# Altium schematic sheet Sheet1.SchDoc
size A2
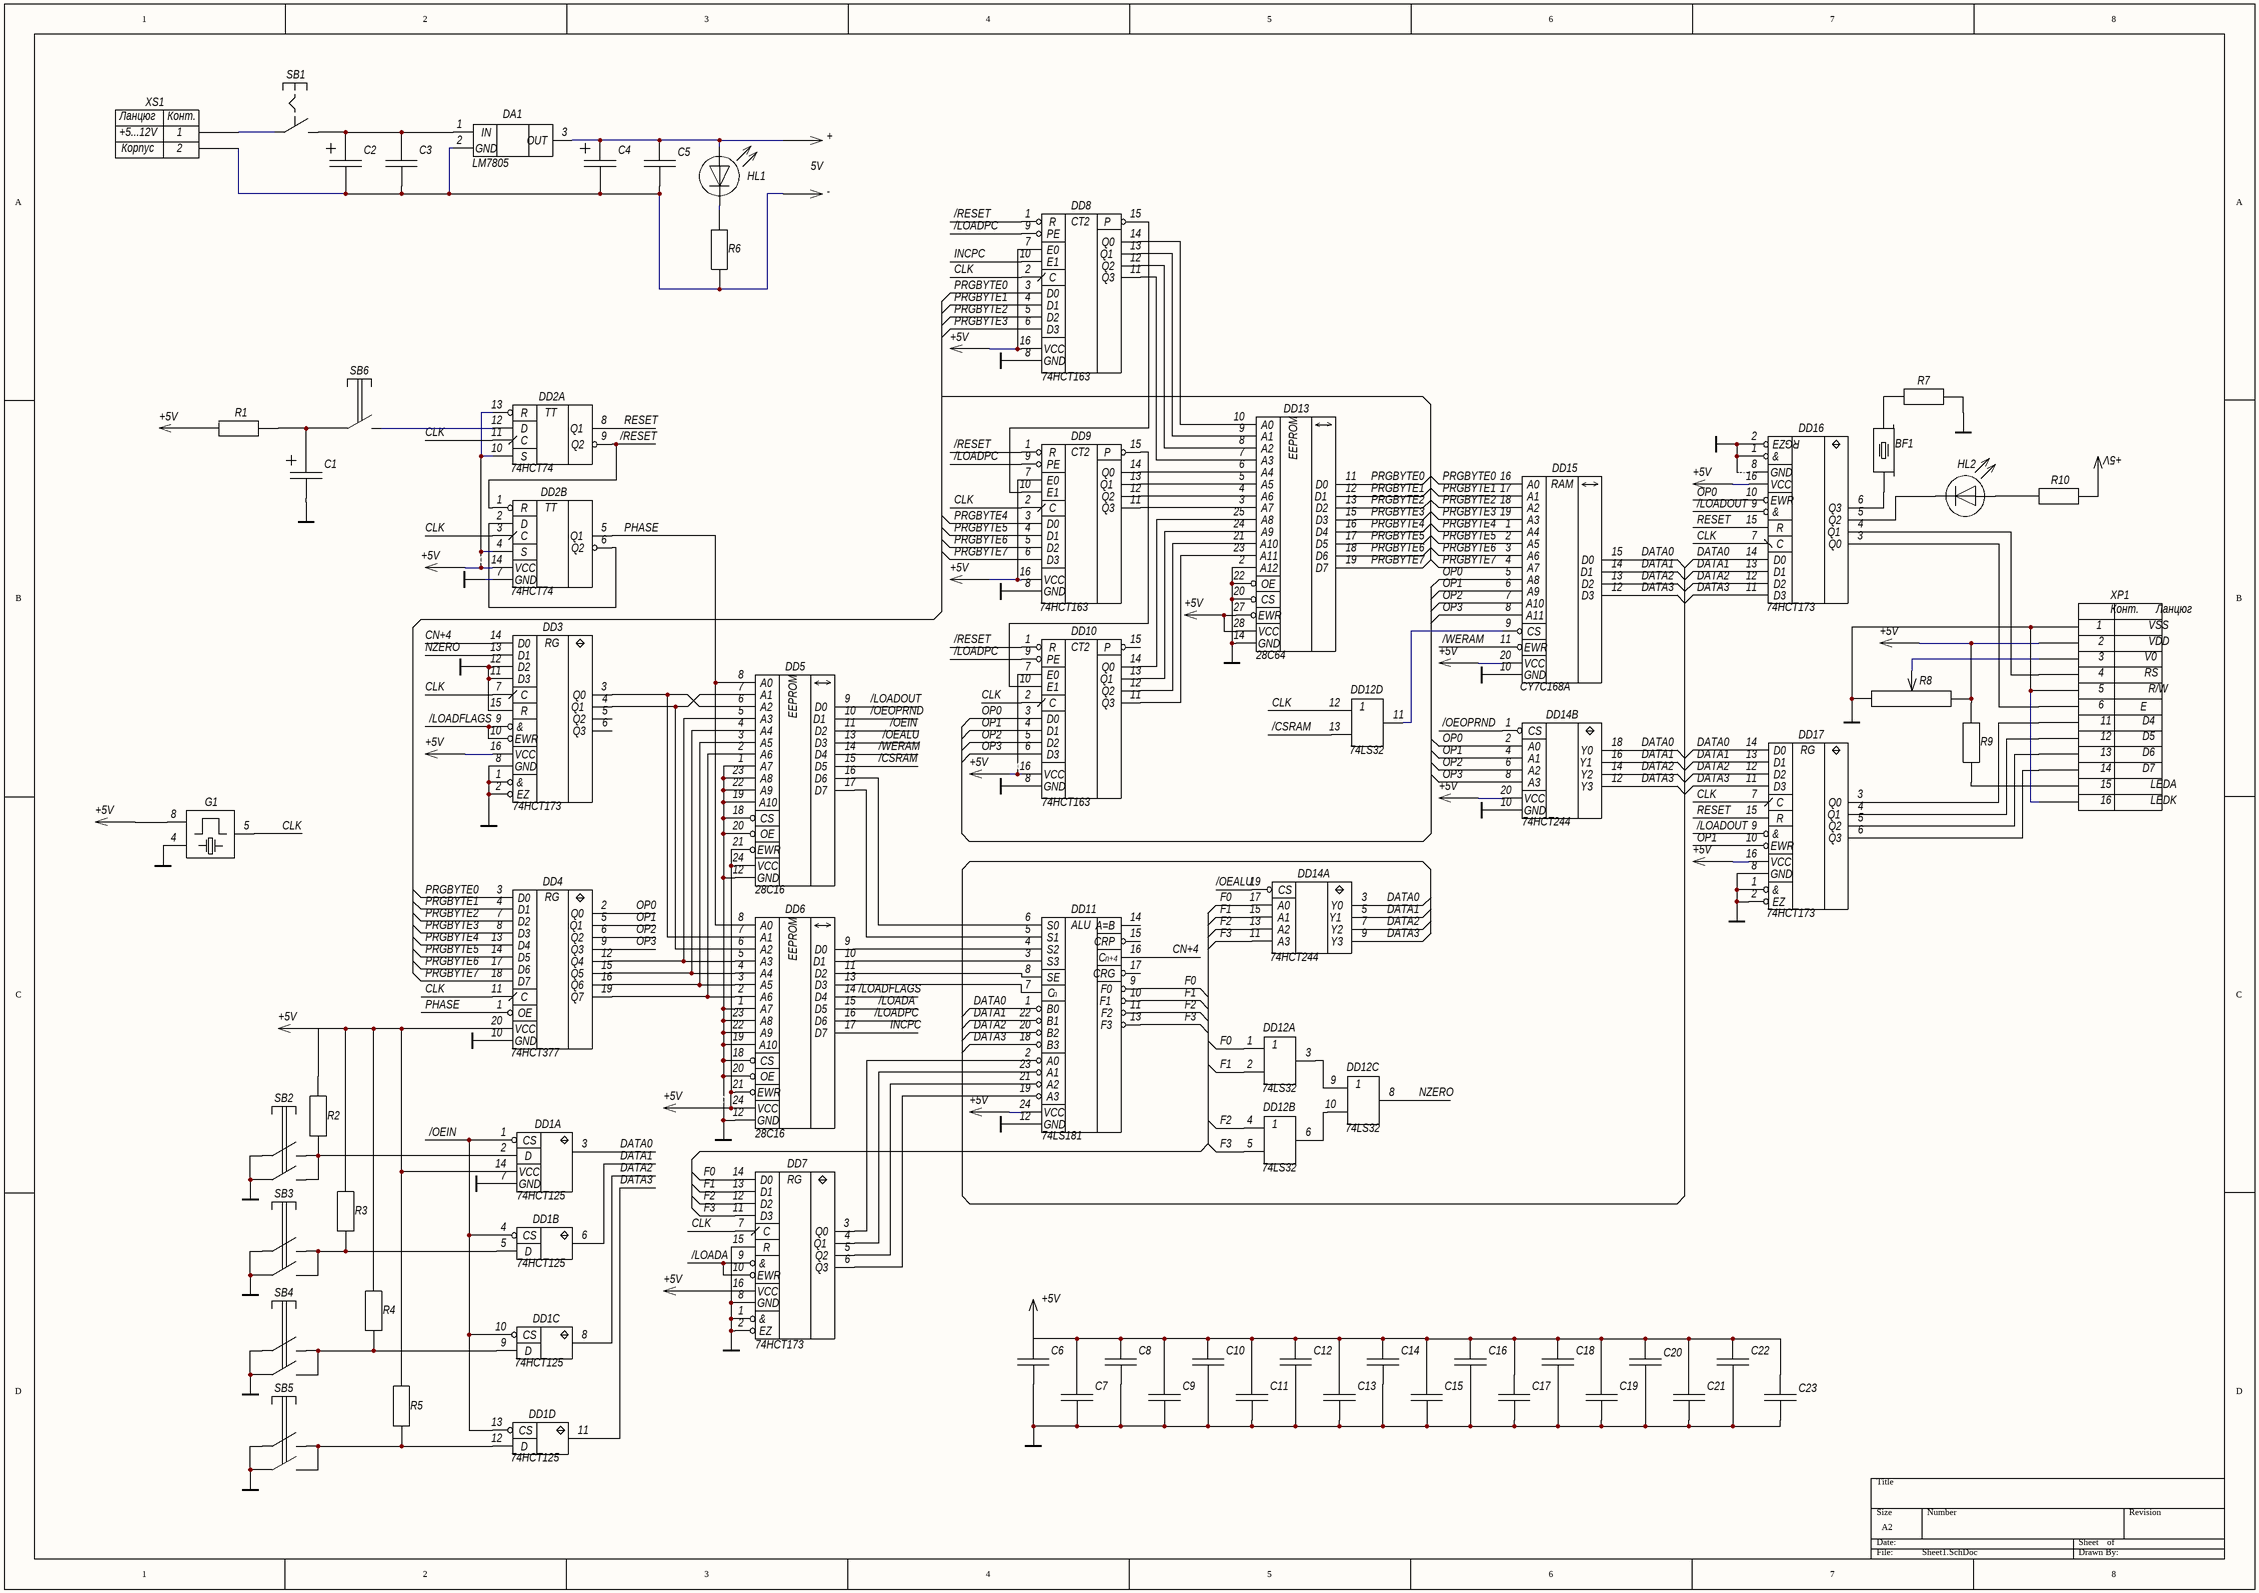
[diagram p0: Sheet1.SchDoc]

## Parts
(Parts that share a designator on the sheet are numbered #1, #2 ... from top to bottom, then left to right.)
BF1  BUZZER  [BUZZER]  (value not drawn)
C1  EL_CAPACITOR  [ELECTROLITE]  (value not drawn)
C2  EL_CAPACITOR  [ELECTROLITE]  (value not drawn)
C3  CAPACITOR  [C0805]  (value not drawn)
C4  EL_CAPACITOR  [ELECTROLITE]  (value not drawn)
C5  CAPACITOR  [C0805]  (value not drawn)
C6  CAPACITOR  [C0805]  (value not drawn)
C7  CAPACITOR  [C0805]  (value not drawn)
C8  CAPACITOR  [C0805]  (value not drawn)
C9  CAPACITOR  [C0805]  (value not drawn)
C10  CAPACITOR  [C0805]  (value not drawn)
C11  CAPACITOR  [C0805]  (value not drawn)
C12  CAPACITOR  [C0805]  (value not drawn)
C13  CAPACITOR  [C0805]  (value not drawn)
C14  CAPACITOR  [C0805]  (value not drawn)
C15  CAPACITOR  [C0805]  (value not drawn)
C16  CAPACITOR  [C0805]  (value not drawn)
C17  CAPACITOR  [C0805]  (value not drawn)
C18  CAPACITOR  [C0805]  (value not drawn)
C19  CAPACITOR  [C0805]  (value not drawn)
C20  CAPACITOR  [C0805]  (value not drawn)
C21  CAPACITOR  [C0805]  (value not drawn)
C22  CAPACITOR  [C0805]  (value not drawn)
C23  CAPACITOR  [C0805]  (value not drawn)
DA1  LM7805  [DPAK254P1054X203-3N]
DD1  74HCT125  [SOIC-14]  (parts A,B,C,D of 4)
DD2  74HCT74  [SOIC-14]  (parts A,B of 2)
DD3  74HCT173  [SOIC-16]
DD4  74HCT377  [SOIC-20]
DD5  28C16  [DIP-24]
DD6  28C16  [DIP-24]
DD7  74HCT173  [SOIC-16]
DD8  74HCT163  [M16A_N]
DD9  74HCT163  [M16A_N]
DD10  74HCT163  [M16A_N]
DD11  74LS181  [DW024_N]
DD12  74LS32  [D014_N]  (parts A,B,C,D of 4)
DD13  28C64  [DIP-28]
DD14  74HCT244  [SOIC-20]  (parts A,B of 2)
DD15  CY7C168A  [SOJ-20]
DD16  74HCT173  [SOIC-16]
DD17  74HCT173  [SOIC-16]
G1  GENERATOR  [ZZ105]  (value not drawn)
HL1  LED  [C0805 - LED]  (value not drawn)
HL2  LED  [C0805 - LED]  (value not drawn)
R1  RESISTOR  [C0805]  (value not drawn)
R2  RESISTOR  [C0805]  (value not drawn)
R3  RESISTOR  [C0805]  (value not drawn)
R4  RESISTOR  [C0805]  (value not drawn)
R5  RESISTOR  [C0805]  (value not drawn)
R6  RESISTOR  [C0805]  (value not drawn)
R7  RESISTOR  [C0805]  (value not drawn)
R8  VARIABLE RES  [V_RES]  (value not drawn)
R9  RESISTOR  [C0805]  (value not drawn)
R10  RESISTOR  [C0805]  (value not drawn)
SB1  BUTTON_3  [BUTTON1]  (value not drawn)
SB2  BUTTON_2  [BUTTON2]  (value not drawn)
SB3  BUTTON_2  [BUTTON2]  (value not drawn)
SB4  BUTTON_2  [BUTTON2]  (value not drawn)
SB5  BUTTON_2  [BUTTON2]  (value not drawn)
SB6  BUTTON  [BUTTON1]  (value not drawn)
VCC#1  CONNECTION  (value not drawn)
VCC#2  CONNECTION  (value not drawn)
VCC#3  CONNECTION  (value not drawn)
VCC#4  CONNECTION  (value not drawn)
VCC#5  CONNECTION  (value not drawn)
VCC#6  CONNECTION  (value not drawn)
VCC#7  CONNECTION  (value not drawn)
VCC#8  CONNECTION  (value not drawn)
VCC#9  CONNECTION  (value not drawn)
VCC#10  CONNECTION  (value not drawn)
VCC#11  CONNECTION  (value not drawn)
VCC#12  CONNECTION  (value not drawn)
VCC#13  CONNECTION  (value not drawn)
VCC#14  CONNECTION  (value not drawn)
VCC#15  CONNECTION  (value not drawn)
VCC#16  CONNECTION  (value not drawn)
VCC#17  CONNECTION  (value not drawn)
VCC#18  CONNECTION  (value not drawn)
VCC#19  CONNECTION  (value not drawn)
VCC#20  CONNECTION  (value not drawn)
VCC#21  CONNECTION  (value not drawn)
XP1  OUTPUT  [STECKER]  (value not drawn)
XS1  INPUT  [KLD-0202]  (value not drawn)

## Nets
GND: C1.2 C2.2 C3.2 C4.2 C5.2 C6.2 C7.2 C8.2 C9.2 C10.2 C11.2 C12.2 C13.2 C14.2 C15.2 C16.2 C17.2 C18.2 C19.2 C20.2 C21.2 C22.2 C23.2 DA1.2(GND) DD1.7(GND) DD2.7(GND) DD3.1(&) DD3.2(EZ) DD3.8(GND) DD3.11(D3) DD3.12(D2) DD3.15(R) DD4.10(GND) DD5.1(A7) DD5.12(GND) DD5.18(CS) DD5.19(A10) DD5.20(OE) DD5.22(A9) DD5.23(A8) DD6.1(A7) DD6.12(GND) DD6.18(CS) DD6.19(A10) DD6.20(OE) DD6.22(A9) DD6.23(A8) DD7.1(&) DD7.2(EZ) DD7.8(GND) DD7.15(R) DD8.8(GND) DD9.8(GND) DD10.8(GND) DD11.12(GND) DD13.2(A12) DD13.14(GND) DD13.20(CS) DD13.22(OE) DD14.10(GND) DD15.10(GND) DD16.1(&) DD16.2(EZ) DD16.8(GND) DD17.1(&) DD17.2(EZ) DD17.8(GND) G1.4 R6.2 R7.1 R8.1 SB2.1 SB2.2 SB3.1 SB3.2 SB4.1 SB4.2 SB5.1 SB5.2 XP1.1(OUTPUT1) XP1.5(OUTPUT5) XP1.16(OUTPUT16) XS1.2(INPUT2) XS1.3(INPUT3)
/CSRAM: DD5.15(D5) DD12.13(B)
/LOADA: DD6.15(D5) DD7.9(&) DD7.10(EWR)
/LOADFLAGS: DD3.9(&) DD3.10(EWR) DD6.14(D4)
/LOADOUT: DD5.9(D0) DD16.9(&) DD17.9(&)
/LOADPC: DD6.16(D6) DD8.9(PE) DD9.9(PE) DD10.9(PE)
/OEALU: DD5.13(D3) DD14.19(CS)
/OEIN: DD1.1(CS) DD1.4(CS) DD1.10(CS) DD1.13(CS) DD5.11(D2)
/OEOPRND: DD5.10(D1) DD14.1(CS)
/RESET: DD2.1(R) DD2.9(Q2) DD8.1(R) DD9.1(R) DD10.1(R)
/WERAM: DD5.14(D4) DD15.11(EWR)
CLK: DD2.3(C) DD2.11(C) DD3.7(C) DD4.11(C) DD7.7(C) DD8.2(C) DD9.2(C) DD10.2(C) DD12.12(A) DD16.7(C) DD17.7(C) G1.5
CN+4: DD3.14(D0) DD11.16(C)
DATA0: DD1.3(Q) DD11.1(B0) DD14.3(Y0) DD14.18(Y0) DD15.15(D0) DD16.14(D0) DD17.14(D0)
DATA1: DD1.6(Q) DD11.22(B1) DD14.5(Y1) DD14.16(Y1) DD15.14(D1) DD16.13(D1) DD17.13(D1)
DATA2: DD1.8(Q) DD11.20(B2) DD14.7(Y2) DD14.14(Y2) DD15.13(D2) DD16.12(D2) DD17.12(D2)
DATA3: DD1.11(Q) DD11.18(B3) DD14.9(Y3) DD14.12(Y3) DD15.12(D3) DD16.11(D3) DD17.11(D3)
F0: DD7.14(D0) DD11.9(F0) DD12.1(A) DD14.17(A0)
F1: DD7.13(D1) DD11.10(F1) DD12.2(B) DD14.15(A1)
F2: DD7.12(D2) DD11.11(F2) DD12.4(A) DD14.13(A2)
F3: DD7.11(D3) DD11.13(F3) DD12.5(B) DD14.11(A3)
INCPC: DD6.17(D7) DD8.10(E1)
INPUT: SB1.1 XS1.1(INPUT1)
NZERO: DD3.13(D1) DD12.8(Y)
OP0: DD4.2(Q0) DD10.3(D0) DD14.2(A0) DD15.5(A8) DD16.10(EWR)
OP1: DD4.5(Q1) DD10.4(D1) DD14.4(A1) DD15.6(A9) DD17.10(EWR)
OP2: DD4.6(Q2) DD10.5(D2) DD14.6(A2) DD15.7(A10)
OP3: DD4.9(Q3) DD10.6(D3) DD14.8(A3) DD15.8(A11)
PHASE: DD2.5(Q1) DD4.1(OE) DD5.8(A0) DD6.8(A0)
PRGBYTE0: DD4.3(D0) DD8.3(D0) DD13.11(D0) DD15.16(A0)
PRGBYTE1: DD4.4(D1) DD8.4(D1) DD13.12(D1) DD15.17(A1)
PRGBYTE2: DD4.7(D2) DD8.5(D2) DD13.13(D2) DD15.18(A2)
PRGBYTE3: DD4.8(D3) DD8.6(D3) DD13.15(D3) DD15.19(A3)
PRGBYTE4: DD4.13(D4) DD9.3(D0) DD13.16(D4) DD15.1(A4)
PRGBYTE5: DD4.14(D5) DD9.4(D1) DD13.17(D5) DD15.2(A5)
PRGBYTE6: DD4.17(D6) DD9.5(D2) DD13.18(D6) DD15.3(A6)
PRGBYTE7: DD4.18(D7) DD9.6(D3) DD13.19(D7) DD15.4(A7)
RESET: DD2.8(Q1) DD16.15(R) DD17.15(R)
VCC: C4.1 C5.1 C6.1 C7.1 C8.1 C9.1 C10.1 C11.1 C12.1 C13.1 C14.1 C15.1 C16.1 C17.1 C18.1 C19.1 C20.1 C21.1 C22.1 C23.1 DA1.3(OUT) DD1.14(VCC) DD2.4(S) DD2.10(S) DD2.13(R) DD2.14(VCC) DD3.16(VCC) DD4.20(VCC) DD5.21(EWR) DD5.24(VCC) DD6.21(EWR) DD6.24(VCC) DD7.16(VCC) DD8.7(E0) DD8.16(VCC) DD9.7(E0) DD9.16(VCC) DD10.7(E0) DD10.16(VCC) DD11.24(VCC) DD13.27(EWR) DD13.28(VCC) DD14.20(VCC) DD15.20(VCC) DD16.16(VCC) DD17.16(VCC) G1.8 HL1.1(A) R1.2 R2.2 R3.2 R4.2 R5.2 R8.3 R9.1 R10.1 XP1.2(OUTPUT2)
NetBF1_1: BF1.1 R7.2
NetBF1_2: BF1.2 DD16.6(Q3)
NetC1_1: C1.1 R1.1 SB6.1
NetC2_1: C2.1 C3.1 DA1.1(IN) SB1.2
NetDD1_2: DD1.2(D) R2.1 SB2.3 SB2.4
NetDD1_5: DD1.5(D) R3.1 SB3.3 SB3.4
NetDD1_9: DD1.9(D) R4.1 SB4.3 SB4.4
NetDD1_12: DD1.12(D) R5.1 SB5.3 SB5.4
NetDD2_2: DD2.2(D) DD2.6(Q2)
NetDD2_12: DD2.12(D) SB6.2
NetDD3_3: DD3.3(Q0) DD5.6(A2) DD6.7(A1)
NetDD3_4: DD3.4(Q1) DD5.7(A1) DD6.6(A2)
NetDD4_12: DD4.12(Q4) DD5.5(A3) DD6.5(A3)
NetDD4_15: DD4.15(Q5) DD5.4(A4) DD6.4(A4)
NetDD4_16: DD4.16(Q6) DD5.3(A5) DD6.3(A5)
NetDD4_19: DD4.19(Q7) DD5.2(A6) DD6.2(A6)
NetDD5_16: DD5.16(D6) DD11.6(S0)
NetDD5_17: DD5.17(D7) DD11.5(S1)
NetDD6_9: DD6.9(D0) DD11.4(S2)
NetDD6_10: DD6.10(D1) DD11.3(S3)
NetDD6_11: DD6.11(D2) DD11.8(SE)
NetDD6_13: DD6.13(D3) DD11.7(C)
NetDD7_3: DD7.3(Q0) DD11.2(A0)
NetDD7_4: DD7.4(Q1) DD11.23(A1)
NetDD7_5: DD7.5(Q2) DD11.21(A2)
NetDD7_6: DD7.6(Q3) DD11.19(A3)
NetDD8_11: DD8.11(Q3) DD13.7(A3)
NetDD8_12: DD8.12(Q2) DD13.8(A2)
NetDD8_13: DD8.13(Q1) DD13.9(A1)
NetDD8_14: DD8.14(Q0) DD13.10(A0)
NetDD8_15: DD8.15(P) DD9.10(E1)
NetDD9_11: DD9.11(Q3) DD13.3(A7)
NetDD9_12: DD9.12(Q2) DD13.4(A6)
NetDD9_13: DD9.13(Q1) DD13.5(A5)
NetDD9_14: DD9.14(Q0) DD13.6(A4)
NetDD9_15: DD9.15(P) DD10.10(E1)
NetDD10_11: DD10.11(Q3) DD13.23(A11)
NetDD10_12: DD10.12(Q2) DD13.21(A10)
NetDD10_13: DD10.13(Q1) DD13.24(A9)
NetDD10_14: DD10.14(Q0) DD13.25(A8)
NetDD12_3: DD12.3(Y) DD12.9(A)
NetDD12_6: DD12.6(Y) DD12.10(B)
NetDD12_11: DD12.11(Y) DD15.9(CS)
NetDD16_3: DD16.3(Q0) XP1.6(OUTPUT6)
NetDD16_4: DD16.4(Q1) XP1.4(OUTPUT4)
NetDD16_5: DD16.5(Q2) HL2.2(C)
NetDD17_3: DD17.3(Q0) XP1.11(OUTPUT11)
NetDD17_4: DD17.4(Q1) XP1.12(OUTPUT12)
NetDD17_5: DD17.5(Q2) XP1.13(OUTPUT13)
NetDD17_6: DD17.6(Q3) XP1.14(OUTPUT14)
NetHL1_2: HL1.2(C) R6.1
NetHL2_1: HL2.1(A) R10.2
NetR8_2: R8.2 XP1.3(OUTPUT3)
NetR9_2: R9.2 XP1.15(OUTPUT15)

Not connected (* = marked no-connect by the designer): DD3 5(Q2) 6(Q3); DD10 15(P); DD11 14(A=B) 15(CRP) 17(CRG); DD12 7(GND) 14(VCC); DD13 1(NC); G1 1; XP1 7(OUTPUT7) 8(OUTPUT8) 9(OUTPUT9) 10(OUTPUT10)

## Notes on the sheet
- (near VCC#1) +
- (near VCC#1) 5V
- (near VCC#2) -
- (near VCC#3) +5V
- (near VCC#4) +5V
- +5V
- (near VCC#5) +5V
- (near VCC#7) +5V
- (near VCC#8) +5V
- (near VCC#9) +5V
- (near VCC#10) +5V
- (near VCC#11) +5V
- (near VCC#12) +5V
- (near VCC#13) +5V
- (near VCC#14) +5V
- (near VCC#15) +5V
- (near VCC#16) +5V
- (near VCC#17) +5V
- (near VCC#18) +5V
- (near VCC#19) +5V
- (near VCC#20) +5V
- (near VCC#21) +5V
- (in symbol 74HCT74_, part A) TT
- (in symbol 74HCT74_, part B) TT
- (in symbol 74HCT163) CT2
- (in symbol 74HCT173) RG
- (in symbol 74HCT173_2) RG
- (in symbol 74HCT377) RG
- (in symbol 74LS181) ALU; n+4; n
- (in symbol AT28C16) EEPROM
- (in symbol AT28C64) EEPROM
- (in symbol CY7C168A) RAM
- (in symbol INPUT) Ланцюг; Конт.; +5...12V; Корпус
- (in symbol OUTPUT) Конт.; Ланцюг; VSS; VDD; V0; RS; R/W; E; D4; D5; D6; D7; LEDA; LEDK

## Library data of the parts
BF1 = BUZZER: П'єзок.динамік
C1 C2 C4 = EL_CAPACITOR: Кондесатор елктр.
C3 C5-C23 = CAPACITOR: Конденс. керам.
DA1 = LM7805: V_REGULATOR
DD1 = 74HCT125: 4 буферні елем.
DD2 = 74HCT74_: Два D-трирери
DD3 DD7 DD17 = 74HCT173: 4-розр. регістр
DD4 = 74HCT377: 8-розр. регістр
DD5 DD6 = AT28C16: 16K EEPROM
DD8-DD10 = 74HCT163: 4-розр. дв. ліч.
DD11 = 74LS181: Швийкісний ALU
DD12 = 74LS32: 4 елем. 2АБО
DD13 = AT28C64: 64K EEPROM
DD14 = 74HCT244_: Драйвер шини
DD15 = CY7C168A: Статичний ОЗП
DD16 = 74HCT173_2
G1 = GENERATOR: Генератор кварц
HL1 HL2 = LED: Світлодіод
R1-R7 R9 R10 = RESISTOR: Резистор постійний
R8 = VARIABLE RES: Резистор змінний
SB1 = BUTTON_3: Копка з фіксац
SB2-SB5 = BUTTON_2: Копка натискна
SB6 = BUTTON: Копка натискна
VCC#1-VCC#21 = CONNECTION: Живлення